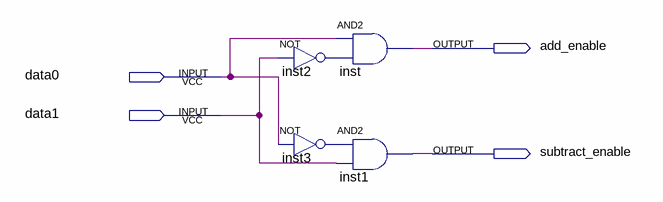
[diagram p0: schematic sheet]
// Quartus schematic add_subt_decision.bdf as structural Verilog: 4 symbols, 4 pins
module add_subt_decision (
  input  data0,
  input  data1,
  output add_enable,
  output subtract_enable
);

  wire inst2_out, inst3_out;

  not inst2 (inst2_out, data1);
  not inst3 (inst3_out, data0);
  and inst (add_enable, data0, inst2_out);
  and inst1 (subtract_enable, inst3_out, data1);
endmodule
